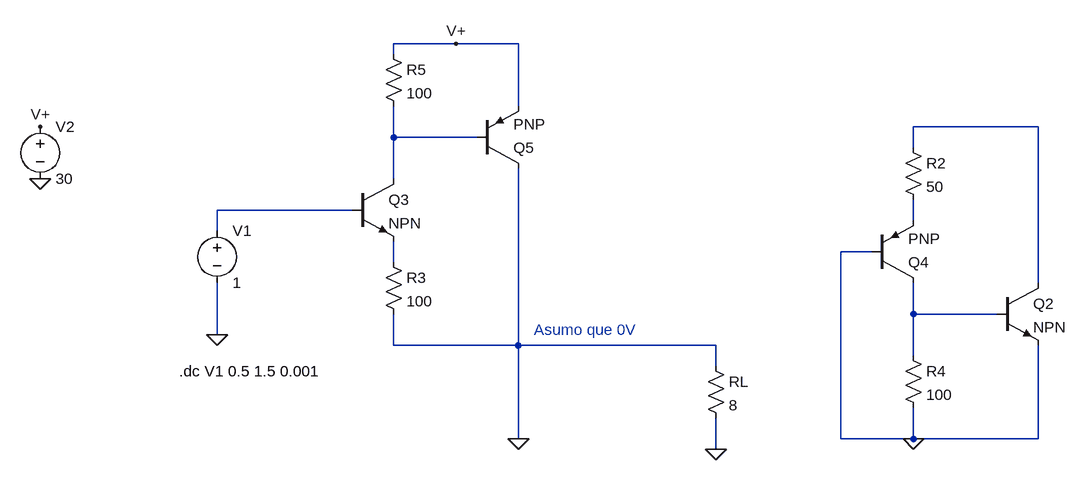
[diagram p0: schematic parte_salida.asc]
parte_salida.asc, the LTspice schematic file:
Version 4
SHEET 1 1228 740
WIRE 288 -208 192 -208
WIRE 384 -208 288 -208
WIRE 192 -192 192 -208
WIRE 384 -112 384 -208
WIRE 1184 -80 992 -80
WIRE 192 -64 192 -112
WIRE 320 -64 192 -64
WIRE 992 -48 992 -80
WIRE 192 0 192 -64
WIRE 128 48 -80 48
WIRE 992 64 992 32
WIRE -80 80 -80 48
WIRE 928 112 880 112
WIRE 192 128 192 96
WIRE 1184 160 1184 -80
WIRE 992 208 992 160
WIRE 1120 208 992 208
WIRE -80 240 -80 160
WIRE 192 256 192 208
WIRE 384 256 384 -16
WIRE 384 256 192 256
WIRE 688 256 384 256
WIRE 992 272 992 208
WIRE 688 288 688 256
WIRE 384 400 384 256
WIRE 880 400 880 112
WIRE 992 400 992 352
WIRE 992 400 880 400
WIRE 1184 400 1184 256
WIRE 1184 400 992 400
WIRE 688 416 688 368
FLAG 688 416 0
FLAG 992 400 0
FLAG -80 240 0
FLAG 288 -208 V+
FLAG -352 0 0
FLAG -352 -80 V+
FLAG 384 400 0
SYMBOL npn 128 0 R0
SYMATTR InstName Q3
SYMBOL npn 1120 160 R0
SYMATTR InstName Q2
SYMBOL pnp 320 -16 M180
SYMATTR InstName Q5
SYMBOL pnp 928 160 M180
SYMATTR InstName Q4
SYMBOL res 176 112 R0
SYMATTR InstName R3
SYMATTR Value 100
SYMBOL res 976 -64 R0
SYMATTR InstName R2
SYMATTR Value 50
SYMBOL res 176 -208 R0
SYMATTR InstName R5
SYMATTR Value 100
SYMBOL res 976 256 R0
SYMATTR InstName R4
SYMATTR Value 100
SYMBOL res 672 272 R0
SYMATTR InstName RL
SYMATTR Value 8
SYMBOL voltage -80 64 R0
WINDOW 123 0 0 Left 0
WINDOW 39 0 0 Left 0
SYMATTR InstName V1
SYMATTR Value 1
SYMBOL voltage -352 -96 R0
WINDOW 123 0 0 Left 0
WINDOW 39 0 0 Left 0
SYMATTR InstName V2
SYMATTR Value 30
TEXT 408 232 Left 2 ;Asumo que 0V
TEXT -138 296 Left 2 !.dc V1 0.5 1.5 0.001

The netlist it stands for:
* parte_salida.asc
Q3 N002 N003 N005 0 NPN
Q2 N001 N006 0 0 NPN
Q5 0 N002 V+ 0 PNP
Q4 N006 0 N004 0 PNP
R3 N005 0 100
R2 N001 N004 50
R5 V+ N002 100
R4 N006 0 100
RL 0 0 8
V1 N003 0 1
V2 V+ 0 30
.model NPN NPN
.model PNP PNP
.lib standard.bjt
* Asumo que 0V
.dc V1 0.5 1.5 0.001
.backanno
.end